# Altium schematic sheet Sch_DSS2_NolanJennifer.SchDoc
size A4; CompanyName: HESSO; Address1: Route du Rawyl 47; Address2: 1950 Sion; Address3: Switzerland; SheetNumber: 1; SheetTotal: 1; PageSetup: Record=PageOptions|CenterHorizontal=True|CenterVertical=True|PrintScale=1.00|XCorrection=1.00|YCorrection=1.00|PrintKind=1|BorderSize=5000000|LeftOffset=0|BottomOffset=0|Orientation=2|PaperLength=1000|PaperWidth=1000|Scale=100|PaperSource=15|PrintQuality=1200|MediaType=1|DitherType=10|PrintScaleMode=1|PaperKind=A4|PaperIndex=9; ProjectName: Project Name
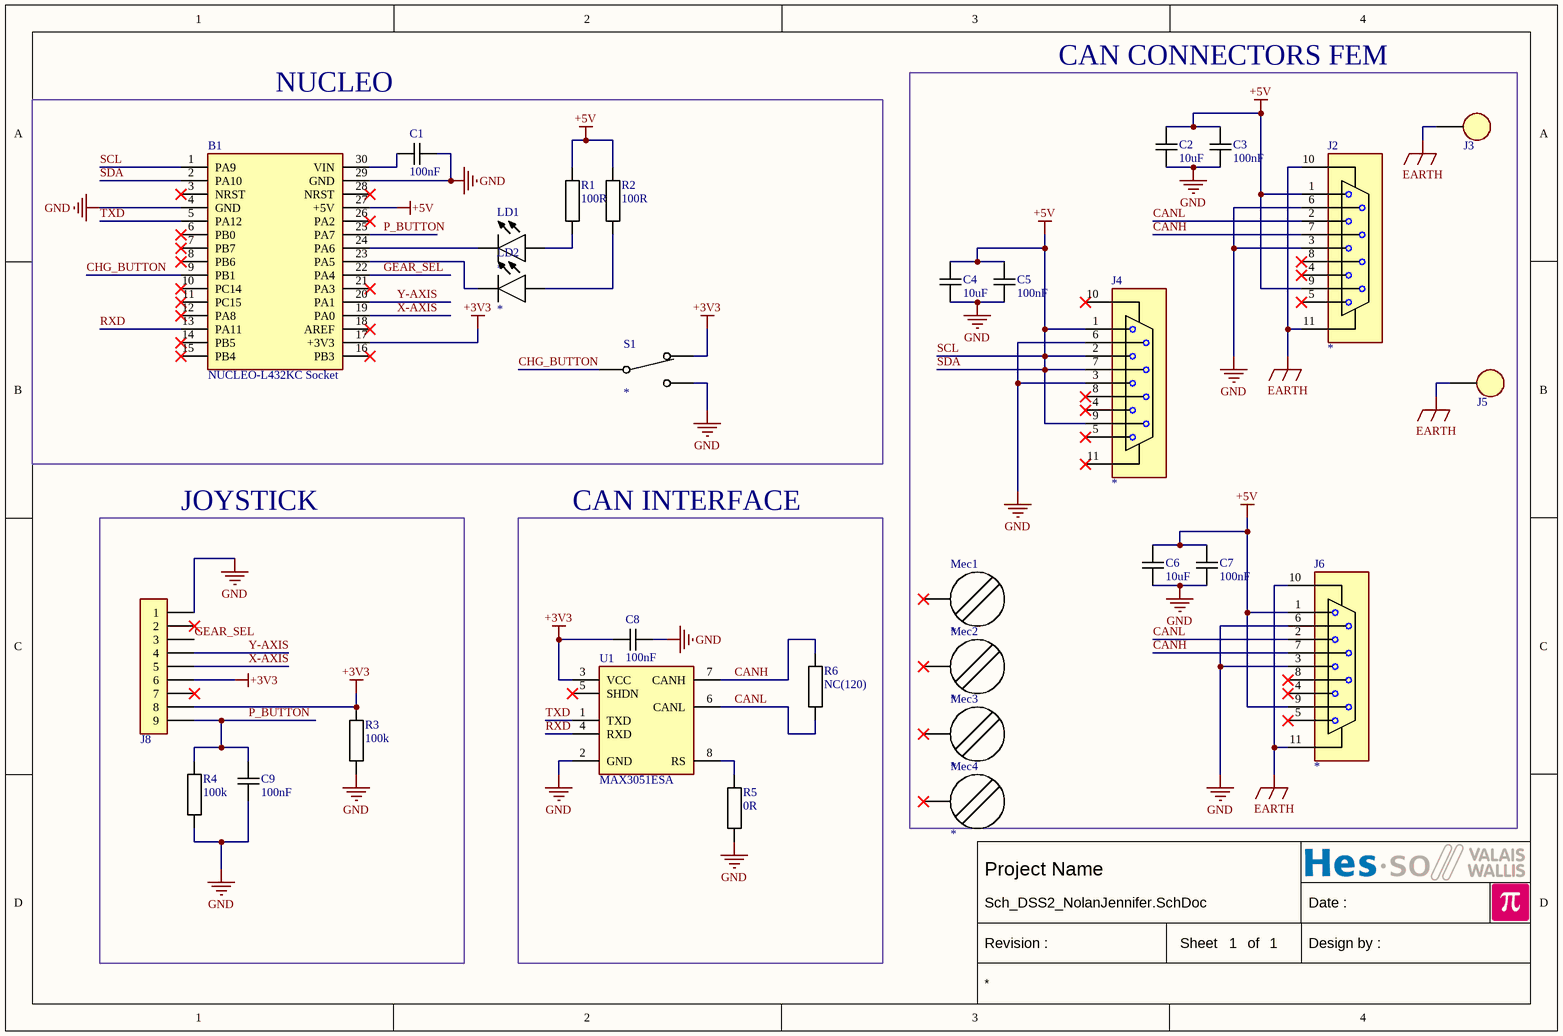
[diagram p0: Sch_DSS2_NolanJennifer.SchDoc]

## Parts
B1  NUCLEO-L432KC Socket  [NUCLEO-L432KC Socket]
C1  100nF  [CAPACITOR 2012 REFLOW]
C2  10uF  [CAPACITOR 2012 REFLOW]
C3  100nF  [CAPACITOR 2012 REFLOW]
C4  10uF  [CAPACITOR 2012 REFLOW]
C5  100nF  [CAPACITOR 2012 REFLOW]
C6  10uF  [CAPACITOR 2012 REFLOW]
C7  100nF  [CAPACITOR 2012 REFLOW]
C8  100nF  [CAPACITOR 2012 REFLOW]
C9  100nF  [CAPACITOR 2012 REFLOW]
J2  *  [D-SUB 9 FEM RND 205-00769]
J3  3867B.68  [FASTON 6.3mm P5.0]  (value not drawn)
J4  *  [D-SUB 9 FEM RND 205-00769]
J5  3867B.68  [FASTON 6.3mm P5.0]  (value not drawn)
J6  *  [D-SUB 9 FEM RND 205-00769]
J8  *  [PinHeader1x9 P2.54]  (value not drawn)
LD1  *  [LED 3216 REFLOW]
LD2  *  [LED 3216 REFLOW]
Mec1  *  [Screw M3X5 Connected]
Mec2  *  [Screw M3X5 Connected]
Mec3  *  [Screw M3X5 Connected]
Mec4  *  [Screw M3X5 Connected]
R1  100R  [RESISTOR 2012 REFLOW]
R2  100R  [RESISTOR 2012 REFLOW]
R3  100k  [RESISTOR 2012 REFLOW]
R4  100k  [RESISTOR 2012 REFLOW]
R5  0R  [RESISTOR 2012 REFLOW]
R6  NC(120)  [RESISTOR 2012 REFLOW]
S1  *  [SLIDE SWITCH Knitter MFP120]
U1  MAX3051ESA  [SO8 P1.27 C4.0X5.0 H1.75]

## Blocks framed on the sheet
CAN CONNECTORS FEM: C2-C7 J2-J6 Mec1-Mec4
NUCLEO: B1 C1 LD1 LD2 R1 R2 S1
JOYSTICK: C9 J8 R3 R4
CAN INTERFACE: C8 R5 R6 U1

## Nets
+3V3: B1.17(+3V3) C8.1 J8.6 J8.8 R3.2 S1.1(NC) U1.3(VCC)
EARTH: J2.10 J2.11 J3.1 J5.1 J6.10 J6.11
GND: B1.4(GND) B1.29(GND) C1.2 C2.1 C3.1 C4.1 C5.1 C6.1 C7.1 C8.2 C9.1 J2.3 J2.6 J4.3 J4.6 J6.3 J6.6 J8.1 R3.1 R4.1 R5.1 S1.3(NO) U1.2(GND)
SCL: B1.1(PA9) B1.2(PA10) B1.27(+5V) C2.2 C3.2 C4.2 C5.2 C6.2 C7.2 J2.1 J2.9 J4.1 J4.2 J4.7 J4.9 J6.1 J6.9 R1.2 R2.2  [also labelled +5V, SDA]
CANH: J2.7 J6.7 R6.2 U1.7(CANH)
CANL: J2.2 J6.2 R6.1 U1.6(CANL)
CHG_BUTTON: B1.9(PB1) S1.2(com)
GEAR_SEL: B1.22(PA4) J8.3
P_BUTTON: B1.25(PA7) C9.2 J8.9 R4.2
RXD: B1.13(PA11) U1.4(RXD)
TXD: B1.5(PA12) U1.1(TXD)
X-AXIS: B1.19(PA0) J8.5
Y-AXIS: B1.20(PA1) J8.4
NetB1_23: B1.23(PA5) LD2.1(C)
NetB1_24: B1.24(PA6) LD1.1(C)
NetB1_30: B1.30(VIN) C1.1
NetLD1_2: LD1.2(A) R1.1
NetLD2_2: LD2.2(A) R2.1
NetR5_2: R5.2 U1.8(RS)

Not connected (* = marked no-connect by the designer): B1 3(NRST)* 6(PB0)* 7(PB7)* 8(PB6)* 10(PC14)* 11(PC15)* 12(PA8)* 14(PB5)* 15(PB4)* 16(PB3)* 18(AREF)* 21(PA3)* 26(PA2)* 28(NRST)*; J2 4* 5* 8*; J4 4* 5* 8* 10* 11*; J6 4* 5* 8*; J8 2* 7*; Mec1 1*; Mec2 1*; Mec3 1*; Mec4 1*; U1 5(SHDN)*

## Notes on the sheet
- Date :
- Revision :
- Sheet
- of
- Design by :

## Library data of the parts
B1 = NUCLEO-L432KC Socket: ARM Cortex based board; Value: NUCLEO-L432KC Socket
C1-C9 = Capacitor
  C1 C3 C5 C7-C9: Value: 100nF
  C2 C4 C6: Value: 10uF
J2 J4 J6 = D-SUB 9 FEM GROUNDED: D-Subminiature 9 way Socket Right Angle; Value: *
J3 J5 = FASTON 6.3mm P5.0: Faston Right angle Vogt 3867B.68; Value: 3867B.68
J8 = PinHeader1x9: Plug connector; Value: *
LD1 LD2 = LED: LED generic; Value: *
Mec1-Mec4 = Screw Connected: Screw Connected BN330; Value: *
R1-R6 = Resistor
  R1 R2: Value: 100R
  R3 R4: Value: 100k
  R5: Value: 0R
  R6: Value: NC(120)
S1 = Slide Switch 1Pole ON-ON: Value: *
U1 = MAX3051ESA: +3.3V, 1Mbps, Low-Supply-Current CAN Transceiver; Value: MAX3051ESA